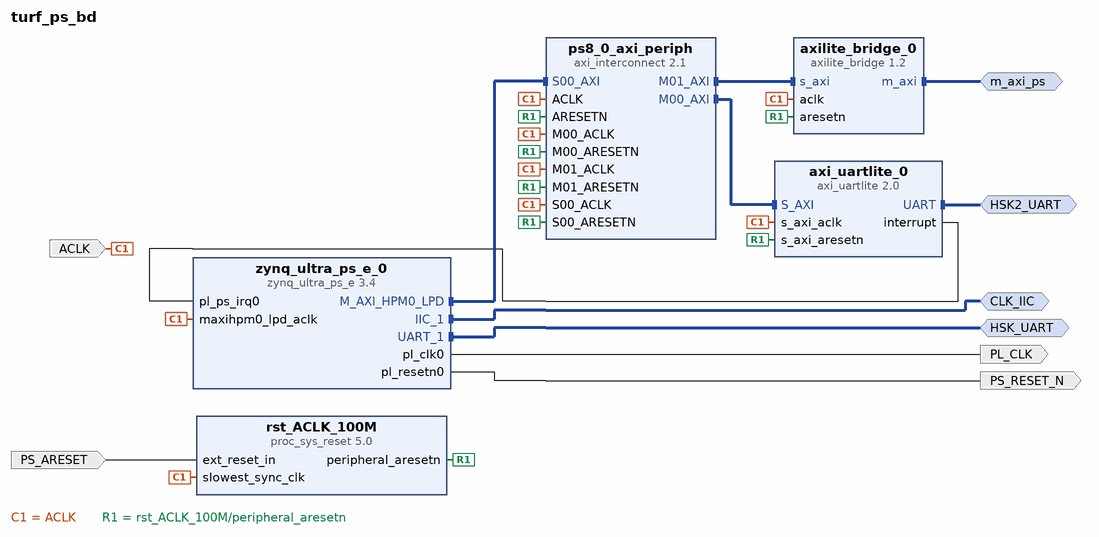
[diagram p0: block diagram of the top level]
# Vivado block design turf_ps_bd, xczu19eg-ffvc1760-1-e, Vivado 2022.2
create_bd_design turf_ps_bd

create_bd_intf_port -mode Master -vlnv xilinx.com:interface:uart_rtl:1.0 HSK_UART
create_bd_intf_port -mode Master -vlnv xilinx.com:interface:iic_rtl:1.0 CLK_IIC
create_bd_intf_port -mode Master -vlnv xilinx.com:interface:uart_rtl:1.0 HSK2_UART
create_bd_intf_port -mode Master -vlnv xilinx.com:interface:aximm_rtl:1.0 m_axi_ps
set_property -dict [list \
  CONFIG.ADDR_WIDTH 28 \
  CONFIG.DATA_WIDTH 32 \
  CONFIG.HAS_BURST 0 \
  CONFIG.HAS_CACHE 0 \
  CONFIG.HAS_LOCK 0 \
  CONFIG.HAS_PROT 0 \
  CONFIG.HAS_QOS 0 \
  CONFIG.HAS_REGION 0 \
  CONFIG.HAS_WSTRB 1 \
  CONFIG.PROTOCOL AXI4LITE \
] [get_bd_intf_ports m_axi_ps]
create_bd_port -dir O -type clk PL_CLK
create_bd_port -dir I -type clk ACLK
create_bd_port -dir O -type rst PS_RESET_N
create_bd_port -dir I -type rst PS_ARESET
set_property -dict {CONFIG.POLARITY ACTIVE_HIGH} [get_bd_ports PS_ARESET]

create_bd_cell -type ip -vlnv xilinx.com:ip:zynq_ultra_ps_e:3.4 zynq_ultra_ps_e_0
set_property -dict [list \
  CONFIG.PSU__CRF_APB__DDR_CTRL__FREQMHZ 800 \
  CONFIG.PSU__DDRC__DEVICE_CAPACITY {8192 MBits} \
  CONFIG.PSU__DDRC__DRAM_WIDTH {16 Bits} \
  CONFIG.PSU__DDRC__SPEED_BIN DDR4_1600L \
  CONFIG.PSU__DDR_HIGH_ADDRESS_GUI_ENABLE 1 \
  CONFIG.PSU__DDR__INTERFACE__FREQMHZ 400.000 \
  CONFIG.PSU__GPIO1_MIO__IO {MIO 26 .. 51} \
  CONFIG.PSU__GPIO1_MIO__PERIPHERAL__ENABLE 1 \
  CONFIG.PSU__I2C0__PERIPHERAL__ENABLE 1 \
  CONFIG.PSU__I2C0__PERIPHERAL__IO {MIO 10 .. 11} \
  CONFIG.PSU__I2C1__PERIPHERAL__ENABLE 1 \
  CONFIG.PSU__I2C1__PERIPHERAL__IO EMIO \
  CONFIG.PSU__UART0__BAUD_RATE 115200 \
  CONFIG.PSU__UART0__MODEM__ENABLE 0 \
  CONFIG.PSU__UART0__PERIPHERAL__ENABLE 1 \
  CONFIG.PSU__UART0__PERIPHERAL__IO {MIO 6 .. 7} \
  CONFIG.PSU__UART1__BAUD_RATE 115200 \
  CONFIG.PSU__UART1__MODEM__ENABLE 0 \
  CONFIG.PSU__UART1__PERIPHERAL__ENABLE 1 \
  CONFIG.PSU__UART1__PERIPHERAL__IO EMIO \
  CONFIG.PSU__USE__IRQ0 1 \
] [get_bd_cells zynq_ultra_ps_e_0]
# 68 more settings of zynq_ultra_ps_e_0 are not shown: defaults, MIO pin electricals, DDR timing, and values the tool derives
create_bd_cell -type ip -vlnv xilinx.com:ip:axi_uartlite:2.0 axi_uartlite_0
create_bd_cell -type ip -vlnv xilinx.com:ip:axi_interconnect:2.1 ps8_0_axi_periph
set_property -dict {CONFIG.NUM_MI 2 CONFIG.NUM_SI 1} [get_bd_cells ps8_0_axi_periph]
create_bd_cell -type ip -vlnv xilinx.com:ip:proc_sys_reset:5.0 rst_ACLK_100M
create_bd_cell -type ip -vlnv ohio-state.edu:user:axilite_bridge:1.2 axilite_bridge_0
set_property -dict {CONFIG.C_AXI_ADDR_WIDTH 28} [get_bd_cells axilite_bridge_0]

# ---- connections ----

connect_bd_intf_net [get_bd_intf_ports HSK2_UART] [get_bd_intf_pins axi_uartlite_0/UART]
connect_bd_intf_net [get_bd_intf_ports m_axi_ps] [get_bd_intf_pins axilite_bridge_0/m_axi]
connect_bd_intf_net [get_bd_intf_pins ps8_0_axi_periph/M00_AXI] [get_bd_intf_pins axi_uartlite_0/S_AXI]
connect_bd_intf_net [get_bd_intf_pins ps8_0_axi_periph/M01_AXI] [get_bd_intf_pins axilite_bridge_0/s_axi]
connect_bd_intf_net [get_bd_intf_ports CLK_IIC] [get_bd_intf_pins zynq_ultra_ps_e_0/IIC_1]
connect_bd_intf_net [get_bd_intf_pins zynq_ultra_ps_e_0/M_AXI_HPM0_LPD] [get_bd_intf_pins ps8_0_axi_periph/S00_AXI]
connect_bd_intf_net [get_bd_intf_ports HSK_UART] [get_bd_intf_pins zynq_ultra_ps_e_0/UART_1]
connect_bd_net [get_bd_ports ACLK] \
  [get_bd_pins zynq_ultra_ps_e_0/maxihpm0_lpd_aclk] [get_bd_pins ps8_0_axi_periph/S00_ACLK] \
  [get_bd_pins rst_ACLK_100M/slowest_sync_clk] [get_bd_pins axi_uartlite_0/s_axi_aclk] \
  [get_bd_pins ps8_0_axi_periph/M00_ACLK] [get_bd_pins ps8_0_axi_periph/ACLK] [get_bd_pins ps8_0_axi_periph/M01_ACLK] \
  [get_bd_pins axilite_bridge_0/aclk]
connect_bd_net [get_bd_pins axi_uartlite_0/interrupt] [get_bd_pins zynq_ultra_ps_e_0/pl_ps_irq0]
connect_bd_net -net reset_rtl_0_1 [get_bd_ports PS_ARESET] [get_bd_pins rst_ACLK_100M/ext_reset_in]
connect_bd_net [get_bd_pins rst_ACLK_100M/peripheral_aresetn] \
  [get_bd_pins ps8_0_axi_periph/S00_ARESETN] [get_bd_pins axi_uartlite_0/s_axi_aresetn] \
  [get_bd_pins ps8_0_axi_periph/M00_ARESETN] [get_bd_pins ps8_0_axi_periph/ARESETN] \
  [get_bd_pins ps8_0_axi_periph/M01_ARESETN] [get_bd_pins axilite_bridge_0/aresetn]
connect_bd_net [get_bd_pins zynq_ultra_ps_e_0/pl_clk0] [get_bd_ports PL_CLK]
connect_bd_net [get_bd_pins zynq_ultra_ps_e_0/pl_resetn0] [get_bd_ports PS_RESET_N]

# ---- address map ----
assign_bd_address -offset 0x0000000 -range 256M -target_address_space [get_bd_addr_spaces axilite_bridge_0/m_axi] [get_bd_addr_segs m_axi_ps/Reg]
assign_bd_address -offset 0x0080000000 -range 64K -target_address_space [get_bd_addr_spaces zynq_ultra_ps_e_0/Data] [get_bd_addr_segs axi_uartlite_0/S_AXI/Reg]
assign_bd_address -offset 0x0090000000 -range 256M -target_address_space [get_bd_addr_spaces zynq_ultra_ps_e_0/Data] [get_bd_addr_segs axilite_bridge_0/s_axi/reg0]

validate_bd_design
save_bd_design
